# Altium schematic sheet v1.0.SchDoc
size 111 x 114 mm; PageSetup: Record=PageOptions|CenterHorizontal=True|CenterVertical=True|PrintScale=0.71|XCorrection=1.00|YCorrection=1.00|PrintKind=1|BorderSize=5000000|LeftOffset=0|BottomOffset=0|Orientation=2|PaperLength=1000|PaperWidth=1000|Scale=100|PaperSource=15|PrintQuality=4000|MediaType=1|DitherType=10|PrintScaleMode=1|PaperKind=A4|PaperIndex=9
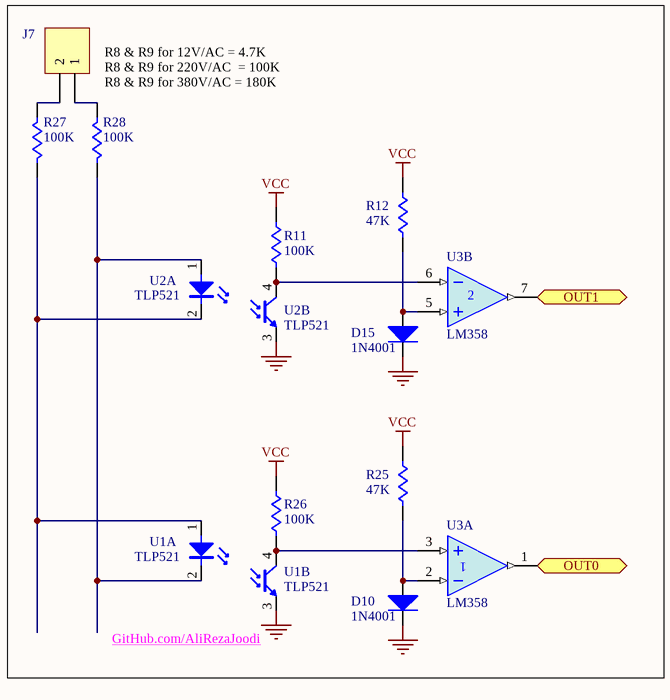
[diagram p0: v1.0.SchDoc]

## Parts
D10  1N4001  [DIODE-0.4]
D15  1N4001  [DIODE-0.4]
J7  Header 2  [Fonics_2PIN_1]  (value not drawn)
R11  value 100K  [AXIAL-0.4]  (hidden comment: Res1)
R12  value 47K  [AXIAL-0.4]  (hidden comment: Res1)
R25  value 47K  [AXIAL-0.4]  (hidden comment: Res1)
R26  value 100K  [AXIAL-0.4]  (hidden comment: Res1)
R27  value 100K  [AXIAL-0.4]  (hidden comment: Res1)
R28  value 100K  [AXIAL-0.4]  (hidden comment: Res1)
U1  value TLP521  [DIP-4]  (hidden comment: Optoisolator)  (parts A,B of 2)
U2  value TLP521  [DIP-4]  (hidden comment: Optoisolator)  (parts A,B of 2)
U3  LM358  [DIP_8]  (parts A,B of 3)

## Ports
OUT0 (out), OUT1 (out)

## Nets
GND: D10.2(K) D15.2(K) U1.3(E) U2.3(E)
VCC: R11.1 R12.1 R25.1 R26.1
OUT0: U3.1(OUT) ; port OUT0
OUT1: U3.7(OUT) ; port OUT1
NetD10_1: D10.1(A) R25.2 U3.2(IN-)
NetD15_1: D15.1(A) R12.2 U3.5(IN+)
NetJ7_1: J7.1 R28.1
NetJ7_2: J7.2 R27.1
NetR11_2: R11.2 U2.4(C) U3.6(IN-)
NetR26_2: R26.2 U1.4(C) U3.3(IN+)
NetR27_2: R27.2 U1.1(A) U2.2(K)
NetR28_2: R28.2 U1.2(K) U2.1(A)

## Notes on the sheet
- R8 & R9 for 12V/AC = 4.7K
  R8 & R9 for 220V/AC  = 100K
  R8 & R9 for 380V/AC = 180K
- (near U1) GitHub.com/AliRezaJoodi

## Library data of the parts
D10 D15 = Diode: Default Diode; Manufacturer: Generic Components; Class I: Discrete; Class II: Diode - Switching; Published: 8-Jun-2000; Revision: July-2002: Re-released for DXP Platform.; Publisher: Altium Limited
J7 = Header 2: Header, 2-Pin; LatestRevisionDate: 17-Jul-2002; LatestRevisionNote: Re-released for DXP Platform.; Publisher: Altium Limited
R11 R12 R25-R28 = Res1: Resistor; Manufacturer: Generic Components; Class I: Passive; Published: 8-Jun-2000; Revision: July-2002: Re-released for DXP Platform.; Publisher: Altium Limited; Class II: Resistor
U3 = LM358: Dual Low-Power Operational Amplifier; Published: 17-Jul-2002; LatestRevisionDate: 13-Apr-2006; LatestRevisionNote: IPC-7351 Footprint Added.; DatasheetVersion: 1988; PackageReference: 751-02; Publisher: Altium Limited; PackageDescription: 8-Pin Small Outline Integrated Circuit 1.27 mm Pitch; Code_JEDEC: MS-012-AA; Code_IPC: SOIC127P600-8; ComponentLink1Description: Manufacturer Link; ComponentLink1URL: http://www.onsemi.com/site/products/parametrics/0,4446,251,00.html; ComponentLink2Description: Datasheet; ComponentLink2URL: http://www.onsemi.com/pub/Collateral/LM358-D.PDF
U1 U2 = Optoisolator: Publisher: Altium Limited